# EAGLE design tsmp77000_breakout (EAGLE 8.7.0)
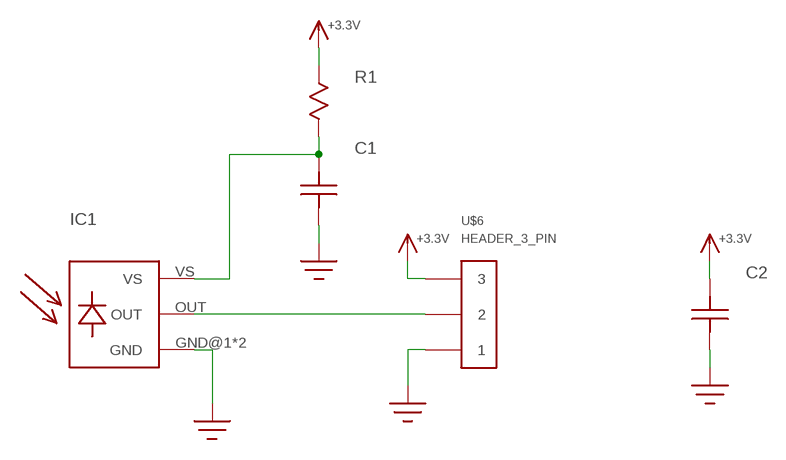
[diagram p0: schematic, sheet 1]

## Parts
C1  C0805  [0805]
C2  C1206  [1206]
IC1  TSMP77000  [TSMP77000]
R1  R0805  [R0805]
U$6  HEADER_3_PIN  [HEADER_3_PIN]

## Nets
+3.3V: C2.P$2 R1.P$1 U$6.3
GND: C1.P$1 C2.P$1 IC1.GND@1(GND) IC1.GND@2(GND) U$6.1
N$1: C1.P$2 IC1.VS R1.P$2
N$4: IC1.OUT U$6.2

## Library data of the parts
C1 C2 = ssir:C
IC1 = ssir:TSMP77000
R1 = ssir:R
U$6 = ssir:HEADER_3_PIN

## Board
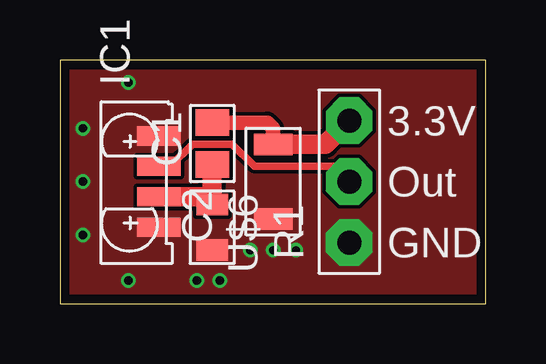
[diagram p1: board, top side]
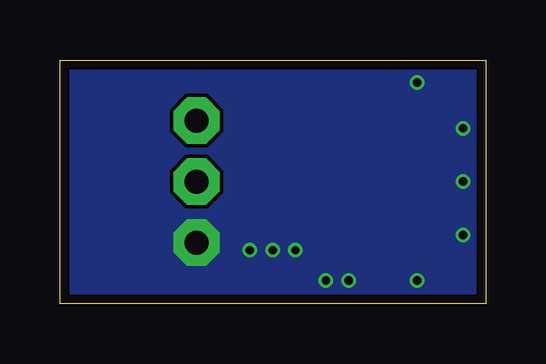
[diagram p2: board, bottom side, seen from below]

Size 17.76 x 10.15 mm. Coordinates in mm from the lower left corner, seen from the top.
Outline: 0,0 17.76,0 17.76,10.15 0,10.15 0,0
Copper layers (1*16): Top 0.035559375mm / dielectric 1.6mm / Bottom 0.035559375mm
Design rules "oshpark-2layer": minimum track width 6mil, minimum drill 10mil, track to track 6mil, track to pad 6mil, pad to pad 6mil, via to via 6mil, smd to smd 6mil, copper to edge 15mil, drill to drill 6mil, minimum pad ring 5mil, minimum via ring 5mil, stop-mask expansion 2.5mil, vias tented up to drill 0mil, thermal gap 10mil

### Footprints (pad centres in the part's own frame; a part is rotated, then mirrored left to right if it is on the bottom)
0805 = smd 0.9 x 1.3: P$1 -0.95,0; P$2 0.95,0
1206 = smd 0.9 x 1.6: P$1 -1.55,0; P$2 1.55,0
TSMP77000 = smd 0.8 x 1.8: GND@1 -1.905,0; GND@2 1.905,0; OUT 0.635,0; VS -0.635,0
R0805 = smd 1.1 x 1.4: P$1 -0.875,0; P$2 0.875,0
HEADER_3_PIN = drill 1 pad 1.93 octagon: 1 -2.54,0; 2 0,0; 3 2.54,0

### Placement (x,y rotation side)
C1  6.35,3.17 90 top
C2  8.89,5.08 90 top
IC1  4.13,5.08 90 top
R1  6.35,6.67 270 top
U$6  12.06,5.08 90 top

### Tracks (layer width: path | path; a pad name or v marks a point on that pad's centre or on a via)
+3.3V
  Top 0.61: R1.P$1 8.65,7.54 8.89,7.3 C2.P$2
  Top 0.813: C2.P$2 11.07,6.63 U$6.3
GND  (via drill 0.35)
  other vias: 2.86,9.21 0.95,7.3 0.95,5.08 0.95,2.86 2.86,0.95 5.71,0.95 6.67,0.95 7.94,2.22 8.89,2.22 9.84,2.22
  pour Top (no thermals): 0,0 17.78,0 17.78,10.16 0,10.16
  pour Bottom (no thermals): 0,0 17.78,0 17.78,10.16 0,10.16
N$1
  Top 0.813: R1.P$2 6.35,4.45 | 6.35,4.45 C1.P$2 | IC1.VS 6.35,4.45
N$4
  Top 0.305: U$6.2 11.43,5.71 8.11,5.71 7.18,6.65 5.52,6.65 4.59,5.71 IC1.OUT

### Text on the board
tPlace: 3.3V | Out | GND